# EAGLE design KeyHolder (EAGLE 9.4.0)
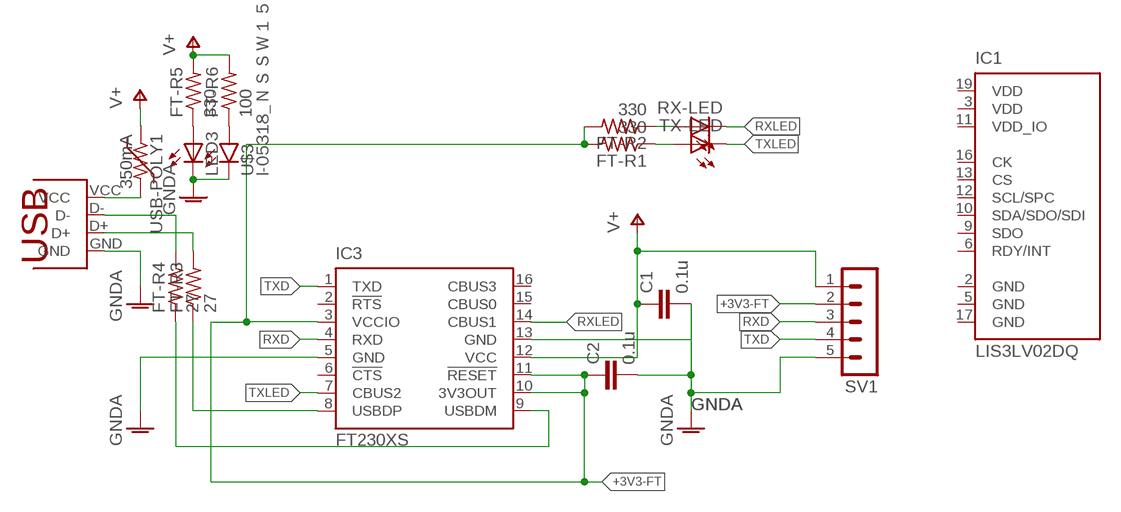
[diagram p0: schematic, sheet 1]

## Parts
C1  0.1u  C-EUC1608  [C1608]
C2  0.1u  C-EUC1608  [C1608]
FT-R1  330  R-US_R0805  [R0805]
FT-R2  330  R-US_R0805  [R0805]
FT-R3  27  R-US_R0805  [R0805]
FT-R4  27  R-US_R0805  [R0805]
FT-R5  330  R-US_R0805  [R0805]
FT-R6  100  R-US_R0805  [R0805]
IC1  LIS3LV02DQ  [QFPN-28]
IC3  FT230XS  [SSOP16]
LED3  LEDCHIP-LED0805  [CHIP-LED0805]
RX-LED  LEDCHIP-LED0805  [CHIP-LED0805]
SV1  MA05-1  [MA05-1]
TX-LED  LEDCHIP-LED0805  [CHIP-LED0805]
U$2  USB-PAD  [USB]
U$3  I-05318_ＮＳＳＷ１５７Ｔ  [NSSW157T]
USB-POLY1  350mA  PTC-F0805MP  [F0805MP]

## Nets
+3V3-FT: C2.1 FT-R1.2 FT-R2.2 IC3.3(VCCIO) IC3.10(3V3OUT) IC3.11(!RESET) SV1.2
GNDA: C1.2 C2.2 IC3.5(GND) IC3.13(GND) LED3.C SV1.5 U$2.GND U$3.CATHODE(C)
N$19: FT-R2.1 RX-LED.A
N$20: FT-R1.1 TX-LED.A
N$22: FT-R3.2 U$2.D+
N$23: FT-R3.1 IC3.8(USBDP)
N$24: FT-R4.1 IC3.9(USBDM)
N$25: FT-R4.2 U$2.D-
N$27: U$2.VCC USB-POLY1.2
N$28: FT-R5.1 LED3.A
N$29: FT-R6.1 U$3.ANODE(A)
RXD: IC3.4(RXD) SV1.3
RXLED: IC3.14(CBUS1) RX-LED.C
TXD: IC3.1(TXD) SV1.4
TXLED: IC3.7(CBUS2) TX-LED.C
V+: C1.1 FT-R5.2 FT-R6.2 IC3.12(VCC) SV1.1 USB-POLY1.1
Unconnected: IC1.6(RDY/INT) IC1.9(SDO) IC1.10(SDA/SDO/SDI) IC1.12(SCL/SPC) IC1.13(CS) IC1.16(CK) IC3.2(!RTS) IC3.6(!CTS) IC3.15(CBUS0) IC3.16(CBUS3)

## Power pins joined to a net without a drawn wire
GND: IC1.2(GND) IC1.5(GND) IC1.17(GND)
VDD: IC1.3(VDD) IC1.19(VDD)
VDD_IO: IC1.11(VDD_IO)

## Library data of the parts
C1 C2 = resistor:C-EU: CAPACITOR, European symbol
FT-R1-FT-R6 = 0@Mylibrary-main1:R-US_: RESISTOR, American symbol
IC1 = st-microelectronics:LIS3LV02DQ: MEMS INERTIAL SENSOR 3-Axis - ±2g/±6g Digital Output Low Voltage Linear Accelerometer Source: http://www.st.com/stonline/products/literature/ds/11115/lis3lv02dq.pdf; MF: Arrow Electronics; MPN: LIS3LV02DQ; OC_FARNELL: 1220909; OC_NEWARK: 89K0642
IC3 = ftdichip:FT230X: USB to BASIC UART IC Auto generated by make-symbol-device-package-bsdl.ulp Rev. 43 Source: Data sheet <http://www.ftdichip.com/Support/Documents/DataSheets/ICs/DS_FT230X.pdf>
LED3 RX-LED TX-LED = led:LED: LED OSRAM: - CHIPLED LG R971, LG N971, LY N971, LG Q971, LY Q971, LO R971, LY R971 LH N974, LH R974 LS Q976, LO Q976, LY Q976 LO Q996 - Hyper CHIPLED LW Q18S LB Q993, LB Q99A, LB R99A - SideLED LS A670, LO A670, LY A670, LG A670, LP A670 LB A673, LV A673, LT A673, LW A673 LH A674 LY A675 LS A676, LA A676, LO A676, LY A676, LW A676 LS A679, LY A679, LG A679 - Hyper Micro SIDELED® LS Y876, LA Y876, LO Y876, LY Y876 LT Y87S - SmartLED LW L88C, LW L88S LB L89C, LB L89S, LG L890 LS L89K, LO L89K, LY L89K LS L896, LA L896, LO L896, LY L896 - TOPLED LS T670, LO T670, LY T670, LG T670, LP T670 LSG T670, LSP T670, LSY T670, LOP T670, LYG T670 LG T671, LOG T671, LSG T671 LB T673, LV T673, LT T673, LW T673 LH T674 LS T676, LA T676, LO T676, LY T676, LB T676, LH T676, LSB T676, LW T676 LB T67C, LV T67C, LT T67C, LS T67K, LO T67K, LY T67K, LW E67C LS E67B, LA E67B, LO E67B, LY E67B, LB E67C, LV E67C, LT E67C LW T67C LS T679, LY T679, LG T679 LS T770, LO T770, LY T770, LG T770, LP T770 LB T773, LV T773, LT T773, LW T773 LH T774 LS E675, LA E675, LY E675, LS T675 LS T776, LA T776, LO T776, LY T776, LB T776 LHGB T686 LT T68C, LB T68C - Hyper Mini TOPLED® LB M676 - Mini TOPLED Santana® LG M470 LS M47K, LO M47K, LY M47K Source: http://www.osram.convergy.de LUXEON: - LUMILED® LXK2-PW12-R00, LXK2-PW12-S00, LXK2-PW14-U00, LXK2-PW14-V00 LXK2-PM12-R00, LXK2-PM12-S00, LXK2-PM14-U00 LXK2-PE12-Q00, LXK2-PE12-R00, LXK2-PE12-S00, LXK2-PE14-T00, LXK2-PE14-U00 LXK2-PB12-K00, LXK2-PB12-L00, LXK2-PB12-M00, LXK2-PB14-N00, LXK2-PB14-P00, LXK2-PB14-Q00 LXK2-PR12-L00, LXK2-PR12-M00, LXK2-PR14-Q00, LXK2-PR14-R00 LXK2-PD12-Q00, LXK2-PD12-R00, LXK2-PD12-S00 LXK2-PH12-R00, LXK2-PH12-S00 LXK2-PL12-P00, LXK2-PL12-Q00, LXK2-PL12-R00 Source: www.luxeon.com KINGBRIGHT: KA-3528ASYC Source: www.kingbright.com
SV1 = 0con-lstb:MA05-1: PIN HEADER; OC_FARNELL: unknown; OC_NEWARK: unknown
U$2 = USB-PAD:USB-PAD
U$3 = Akizuki:I-05318_ＮＳＳＷ１５７Ｔ
USB-POLY1 = polyswitch:PTC-: POLYSWITCH Polyswitch Resetable Fuses

## Board
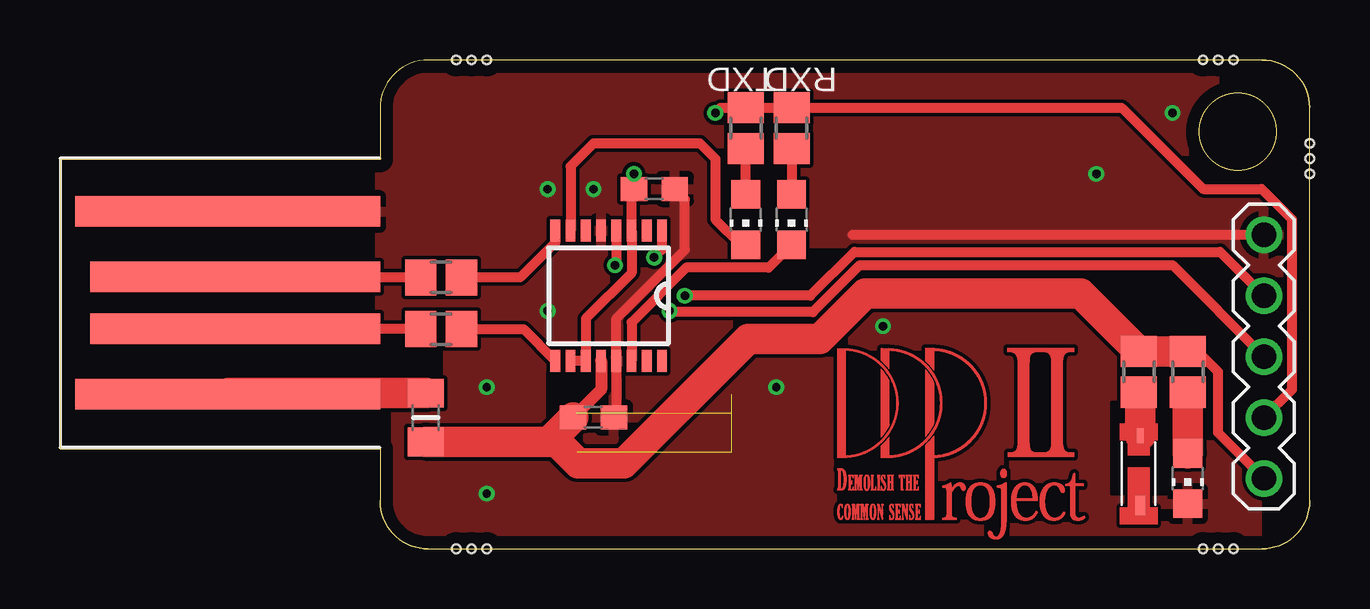
[diagram p1: board, top side]
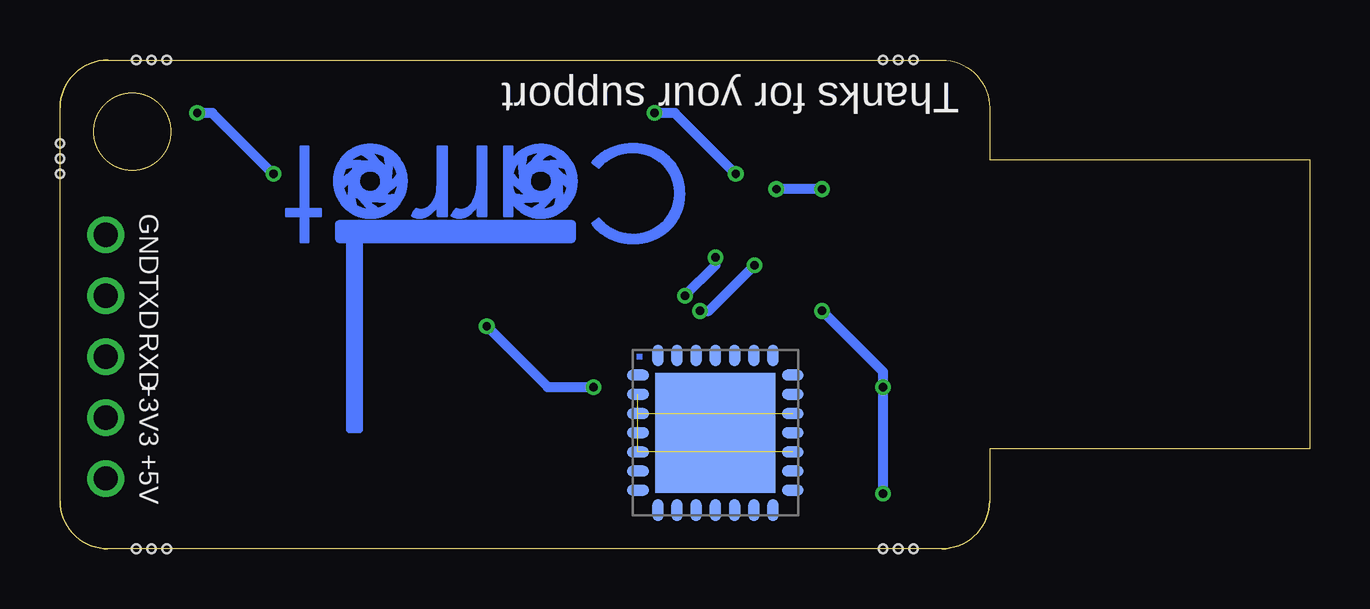
[diagram p2: board, bottom side, seen from below]

Size 52.07 x 20.39 mm. Coordinates in mm from the lower left corner, seen from the top.
Outline: 15.34,20.39 arc90 13.34,18.39
Outline: 50.07,20.39 arc-90 52.07,18.39
Outline: 52.07,2 arc-90 50.07,0
Outline: 15.34,0 arc-90 13.34,2
Outline: 13.34,2 arc90 15.34,0
Outline: 50.07,0 arc90 52.07,2
Outline: 52.07,18.39 arc90 50.07,20.39
Outline: 50.07,20.39 15.34,20.39
Outline: 13.34,2 13.34,4.16 0,4.16 0,16.23 13.34,16.23 13.34,18.39
Outline: 13.34,2 arc90 15.34,0
Outline: 15.34,0 50.07,0
Outline: 50.07,0 arc90 52.07,2
Outline: 52.07,2 52.07,18.39
Outline: 52.07,18.39 arc90 50.07,20.39
Outline: 15.34,20.39 arc90 13.34,18.39
Outline: circle at 49.07,17.39 radius 1.6
Copper layers (1*16): Top 0.035mm / dielectric 1.6mm / Bottom 0.035mm
Design rules "Elecrow_2-layer_PCB_eagle_rule": minimum track width 6mil, minimum drill 12mil, track to track 6mil, track to pad 6mil, pad to pad 6mil, via to via 8mil, smd to smd 0mil, copper to edge 20mil, drill to drill 10mil, minimum pad ring 6mil, minimum via ring 6mil, stop-mask expansion 0mil, vias tented up to drill 100mil, thermal gap 10mil
Holes 0.35 mm at 16.51,0 16.51,20.39 17.14,20.39 17.78,20.39 47.62,20.39 48.26,20.39 48.9,20.39 52.07,15.64 52.07,16.27 52.07,16.91 17.14,0 17.78,0 47.62,0 48.26,0 48.9,0
tRestrict: 10 lines

### Footprints (pad centres in the part's own frame; a part is rotated, then mirrored left to right if it is on the bottom)
C1608 = smd 1.1 x 1: 1 -0.85,0; 2 0.85,0
R0805 = smd 1.3 x 1.5: 1 -0.85,0; 2 0.85,0
QFPN-28 = smd 0.9 x 0.45: 1 -3.225,2.4; 2 -3.225,1.6; 3 -3.225,0.8; 4 -3.225,0; 5 -3.225,-0.8; 6 -3.225,-1.6; 7 -3.225,-2.4; 15 3.225,-2.4; 16 3.225,-1.6; 17 3.225,-0.8; 18 3.225,0; 19 3.225,0.8; 20 3.225,1.6; 21 3.225,2.4 | smd 0.45 x 0.9: 8 -2.4,-3.225; 9 -1.6,-3.225; 10 -0.8,-3.225; 11 0,-3.225; 12 0.8,-3.225; 13 1.6,-3.225; 14 2.4,-3.225; 22 2.4,3.225; 23 1.6,3.225; 24 0.8,3.225; 25 0,3.225; 26 -0.8,3.225; 27 -1.6,3.225; 28 -2.4,3.225 | smd 5 x 5: TH 0,0
SSOP16 = smd 0.914 x 0.406: 1 -2.718,2.223; 2 -2.718,1.587; 3 -2.718,0.953; 4 -2.718,0.318; 5 -2.718,-0.318; 6 -2.718,-0.953; 7 -2.718,-1.587; 8 -2.718,-2.223; 9 2.718,-2.223; 10 2.718,-1.587; 11 2.718,-0.953; 12 2.718,-0.318; 13 2.718,0.318; 14 2.718,0.953; 15 2.718,1.587; 16 2.718,2.223
CHIP-LED0805 = smd 1.2 x 1.2: A 0,-1.05; C 0,1.05
MA05-1 = drill 1.016: 1 -5.08,0; 2 -2.54,0; 3 0,0; 4 2.54,0; 5 5.08,0
USB = smd 1.27 x 12.065: D+ 7.176,6.032; D- 5.016,6.032 | smd 1.27 x 12.7: GND 9.906,6.35; VCC 2.286,6.35
NSSW157T = smd 0.61 x 0.305: ANODE 3.683,0.711 | smd 0.813 x 0.406: CATHODE 0.762,0.711
F0805MP = smd 1.2 x 1.5: 1 -1.016,0; 2 1.016,0

### Placement (x,y rotation side)
C1  22.23,5.48 0 top
C2  24.77,15 0 top
FT-R1  28.57,17.54 90 top
FT-R2  30.48,17.54 90 top
FT-R3  15.88,11.32 180 top
FT-R4  15.88,9.16 180 top
FT-R5  46.99,7.38 90 top
FT-R6  44.96,7.38 90 top
IC1  24.77,4.84 0 bottom
IC3  22.86,10.56 270 top
LED3  46.99,2.94 180 top
RX-LED  30.48,13.73 180 top
SV1  50.16,8.02 90 top
TX-LED  28.57,13.73 180 top
U$2  13.34,4.16 90 top
U$3  45.72,1.03 90 top
U$5  [CARROT]  26.04,16.91 180 bottom
U$6  [DDPROJECT2-TOP]  32.38,0.4 0 top
USB-POLY1  15.24,5.48 90 top

### Tracks (layer width: path | path; a pad name or v marks a point on that pad's centre or on a via)
+3V3-FT  (via drill 0.35)
  Top 0.406: IC3.10 IC3.11 21.91,9.6 23.81,11.51 IC3.3 23.81,14.9 C2.1 v23.91,15.64 | SV1.2 51.33,6.65 51.33,13.73 50.06,15 47.62,15 44.23,18.39 FT-R2.2 FT-R1.2 27.52,18.39 v27.3,18.18
  Bottom 0.406: v23.91,15.64 26.45,18.18 v27.3,18.18
GND  (2 unrouted)
GNDA  (via drill 0.35)
  Top 0.406: C1.2 23.18,5.58 IC3.13 23.18,9.6 26.04,12.46 26.04,14.58 C2.2 | 33.02,13.1 SV1.5
  Bottom 0.406: v34.29,9.29 31.75,6.75 v29.84,6.75 | v17.78,2.3 v17.78,6.75 17.78,7.38 v20.32,9.92 | v20.32,15 v22.23,15 | v43.18,15.64 45.72,18.18 v46.35,18.18
  pour Top: 13.34,20.08 52.07,20.08 52.07,0.4 13.34,0.4
N$19
  Top 0.406: FT-R2.1 RX-LED.A
N$20
  Top 0.406: TX-LED.A FT-R1.1
N$22
  Top 0.406: U$2.D+ 15,11.34 FT-R3.2
N$23
  Top 0.406: IC3.8 20.64,12.78 19.18,11.32 FT-R3.1
N$24
  Top 0.406: IC3.9 19.32,9.16 FT-R4.1
N$25
  Top 0.406: U$2.D- 7.32,9.16 FT-R4.2
N$27
  Top 1.27: U$2.VCC 7.03,6.49 USB-POLY1.2
N$28
  Top 1.27: LED3.A FT-R5.1
N$29
  Top 1.27: FT-R6.1 45.01,6.48 U$3.ANODE
RXD  (via drill 0.35)
  Top 0.406: IC3.4 23.18,11.87 v23.13,11.83 | SV1.3 46.36,11.83 33.33,11.83 31.37,9.87 25.45,9.87 v25.4,9.92
  Bottom 0.406: v25.4,9.92 25.04,9.92 v23.13,11.83
RXLED
  Top 0.406: RX-LED.C 29.52,11.73 26.09,11.73 23.81,9.45 IC3.14
TXD  (via drill 0.35)
  Top 0.406: IC3.1 25.08,12.47 v24.76,12.15 | SV1.4 48.34,12.38 33.1,12.38 31.27,10.56 v26.04,10.56
  Bottom 0.406: v26.04,10.56 24.76,11.83 v24.76,12.15
TXLED
  Top 0.406: IC3.7 21.27,15.95 22.23,16.91 26.67,16.91 27.3,16.27 27.3,13.73 28.36,12.68 TX-LED.C
V+
  Top 0.406: SV1.1 48.26,4.84 48.26,7.38 47.41,8.23 FT-R5.2
  Top 0.508: C1.1 22.54,6.64 IC3.12
  Top 1.27: 20.36,4.46 C1.1 | USB-POLY1.1 20.36,4.46 | 20.36,4.46 20.7,4.46 21.59,3.57 23.5,3.57 28.68,8.76 31.66,8.76 33.56,10.65 42.54,10.65 FT-R6.2 FT-R5.2
VDD  (1 unrouted)

### Text on the board
tPlace: TXD | RXD
bPlace: Thanks for your support | GND | TXD | RXD | +3V3 | +5V